# EasyEDA Pro project RadioFox.eprj, board PCB7
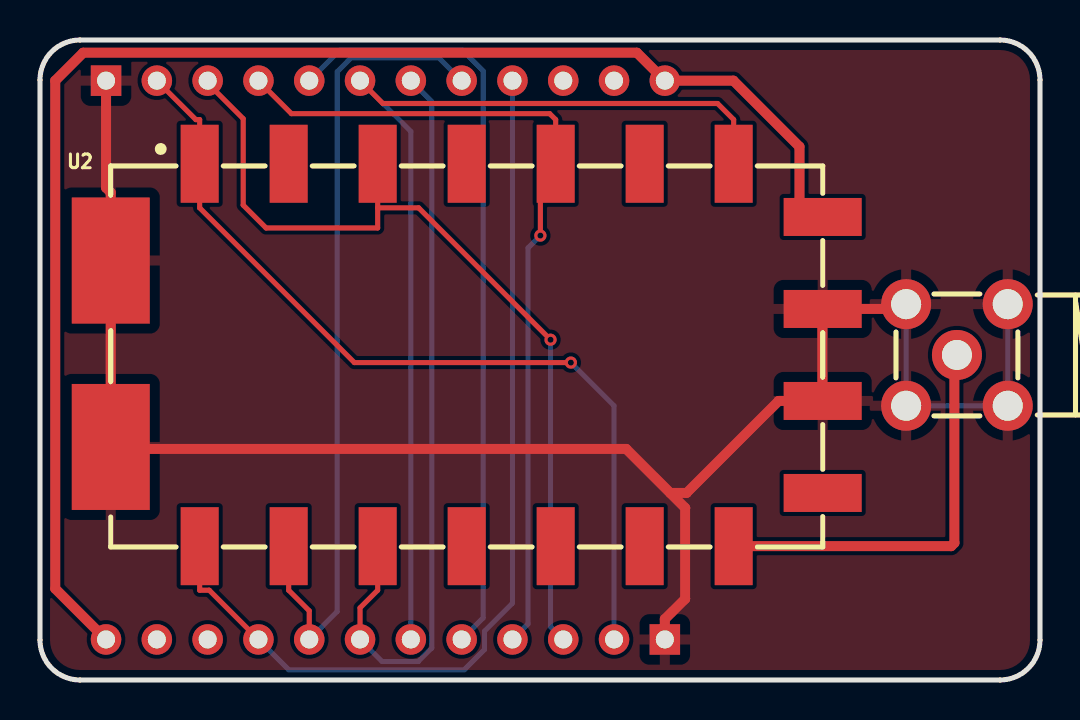
[diagram p6: board, top side]
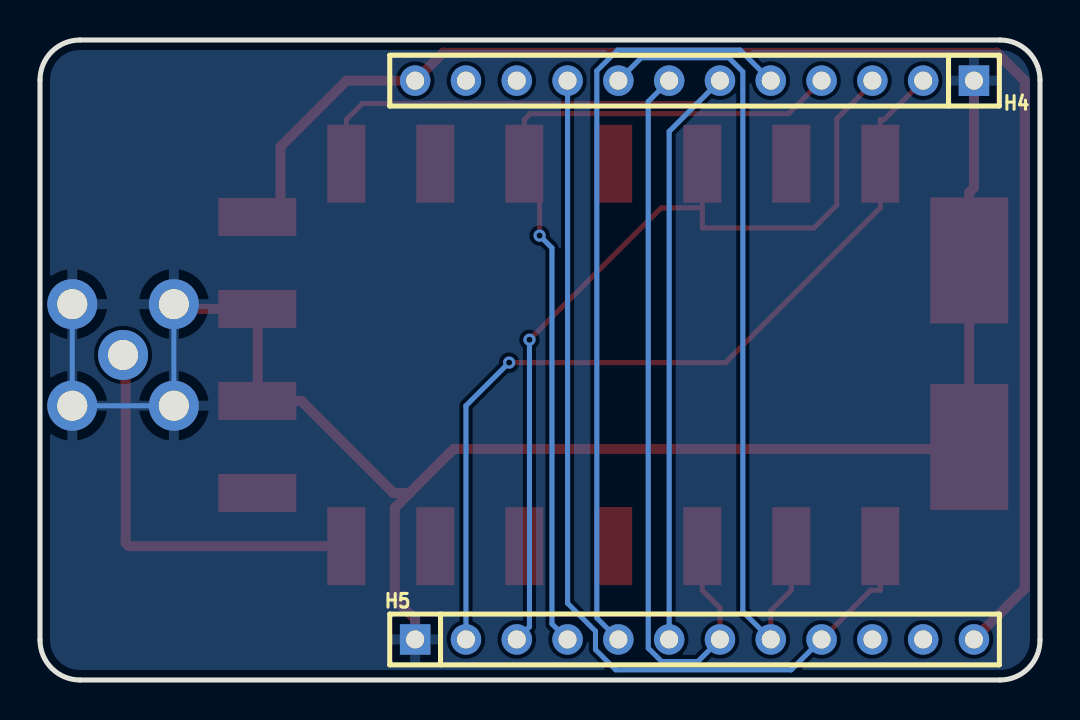
[diagram p7: board, bottom side, seen from below]

Outline 50 x 32 mm; copper layers: Top Layer, Bottom Layer. Coordinates in mm from the lower left corner of the outline.
Outline path: 0,30 0,2 arc(0.59,0.59) 2,0 48,0 arc(49.41,0.59) 50,2 50,30 arc(49.41,31.41) 48,32 2,32 arc(0.59,31.41) 0,30
Stack: Top Layer 0.035mm / Dielectric1 1.51mm FR4 er 4.5 / Bottom Layer 0.035mm

## Design rules (mm)
template: JLCPCB Capability(Two Layers Board)
spacing copperThickness1oz (default): track to track 0.102, other pairs 0.152 to 0.3
spacing copperThickness2oz: track to track 0.203, other pairs 0.152 to 0.3
track width copperThickness1oz (default): min 0.127, default 0.254, max 2.54
track width copperThickness2oz: min 0.203, default 0.254, max 2.54
differential pair differentialPair (default): width min 0.127, default 0.254, max 2.54; gap min 0.152, default 0.152
via viaSize (default): diameter min 0.5, default 0.61, max 10; hole min 0.3, default 0.305, max 6.3

## Placement (name value [footprint] x y rotation side)
H4  XDZ254C-1-12-Z-3.0-G1  [HDR-TH_12P-P2.54-V-M_1]  17.27 29.97 0 bottom
H5  XDZ254C-1-12-Z-3.0-G1  [HDR-TH_12P-P2.54-V-M_1]  17.27 2.03 180 bottom
RF1  KH-SMA-P-8496  [SMA-TH_KH-SMA-P-8496]  45.85 16.25 270 top
U2  SA818S-V  [WIRELM-SMD_G-NICERF_SA818S-X]  21.34 16.25 0 top

## Footprints (pads in the part's own frame, mm; a bottom-side part is the same pattern mirrored in y, then rotated)
HDR-TH_12P-P2.54-V-M_1
  rect 1.524x1.524 hole 0.9: 1(-13.97,0)
  round 1.524 hole 0.9: 2(-11.43,0) 3(-8.89,0) 4(-6.35,0) 5(-3.81,0) 6(-1.27,0) 7(1.27,0) 8(3.81,0) 9(6.35,0) 10(8.89,0) 11(11.43,0) 12(13.97,0)
SMA-TH_KH-SMA-P-8496
  round 2.5 hole 1.5: 1(-2.54,2.54) 2(2.54,2.54) 3(2.54,-2.54) 4(-2.54,-2.54) 5(0,0)
WIRELM-SMD_G-NICERF_SA818S-X
  rect 1.9x3.9 smd: 1(-13.352,9.56) 2(-8.902,9.56) 3(-4.452,9.56) 4(-0.003,9.56) 5(4.447,9.56) 6(8.898,9.56) 7(13.348,9.56) 12(13.348,-9.56) 13(8.898,-9.56) 14(4.447,-9.56) 15(-0.003,-9.56) 16(-4.452,-9.56) 17(-8.902,-9.56) 18(-13.352,-9.56)
  rect 3.9x1.9 smd: 8(17.797,6.9) 9(17.797,2.3) 10(17.797,-2.3) 11(17.797,-6.9)
  rect 3.9x6.3 smd: 19(-17.797,-4.6) 20(-17.797,4.72)

## Nets
GND: H4.1 H5.1 RF1.1 RF1.2 RF1.3 RF1.4 U2.9 U2.10 U2.19 U2.20
VDD: H4.12 H5.12 U2.8
AF_OUT: H4.3 H5.3 U2.3
AUDIO_ON: H4.2 H5.2 U2.1
H/L: H4.6 H5.6 U2.7
MIC_IN: H4.9 H5.9 U2.18
PTT: H4.4 H5.4 U2.5
RXD: H4.7 H5.7 U2.16
SLEEP: H4.5 H5.5
TXD: H4.8 H5.8 U2.17
$1N852: RF1.5 U2.12
$1N1686: U2.6

Pads without a net: H4 10 11; H5 10 11; U2 2 4 11 13 14 15

## Via types
v1: diameter 0.61, hole 0.305, Top Layer to Bottom Layer, 3 vias

## Routing (per net, layer and track width the routed paths; a pad name or vN(x,y) marks a point on that pad's centre or on a via; arc(x,y) is an arc through that point)
GND: length 88.4
  Top Layer w0.5: RF1.4 43.07,18.55 39.26,18.55 39.12,18.41 39.12,14.45 38.62,13.95 36.93,13.95 32.33,9.35 31.51,9.35 ; 31.51,9.35 29.31,11.55 4.04,11.55 3.54,12.05 3.54,24.38 3.3,24.61 H4.1 ; 31.51,9.35 32.26,8.61 32.26,4.05 31.24,3.05 H5.1
  Bottom Layer w0.254: RF1.4 RF1.3 RF1.2 RF1.1
VDD: length 73.4
  Top Layer w0.5: 39.13,23.15 37.97,23.15 37.97,26.67 34.67,29.97 H4.12 29.84,31.36 2.16,31.36 0.76,29.97 0.76,4.57 H5.12
AF_OUT: length 44
  Top Layer w0.254: H4.3 8.38,29.84 10.16,28.06 10.16,23.75 11.3,22.6 16.88,22.6 16.88,23.61 ; 16.88,23.61 18.93,23.61 v1(25.53,17.01) ; 16.88,23.61 U2.3
  Bottom Layer w0.254: v1(25.53,17.01) 25.53,2.66 26.16,2.03
AUDIO_ON: length 43.9
  Top Layer w0.254: 5.84,29.97 7.79,28.02 7.98,28.02 U2.1 7.98,23.61 15.72,15.87 v1(26.54,15.87)
  Bottom Layer w0.254: H5.2 28.7,13.71 v1(26.54,15.87)
H/L: length 50.7
  Top Layer w0.254: 16,29.97 17.14,28.83 33.88,28.83 34.68,28.02 U2.7
  Bottom Layer w0.254: H5.6 18.54,27.43 16,29.97
MIC_IN: length 47.5
  Top Layer w0.254: 7.98,6.69 7.98,4.49 8.46,4.49 H5.9
  Bottom Layer w0.254: H4.9 23.62,3.84 22.22,2.44 22.22,1.52 21.21,0.51 12.44,0.51 H5.9
PTT: length 42.6
  Top Layer w0.254: v1(25.02,22.22) 25.02,25.05 U2.5 25.78,28.02 25.48,28.32 12.57,28.32 H4.4
  Bottom Layer w0.254: v1(25.02,22.22) 24.4,21.6 24.4,2.81 H5.4
RXD: length 38.2
  Top Layer w0.254: 16.88,6.69 16.88,4.49 16,3.61 16,2.03
  Bottom Layer w0.254: 16,2.03 17.1,0.92 18.92,0.92 19.59,1.59 19.59,28.92 H4.7
SLEEP: length 38.6
  Bottom Layer w0.254: H5.5 22.16,3.1 22.16,30.46 21.12,31.49 14.99,31.49 H4.5
TXD: length 41
  Top Layer w0.254: H5.8 13.46,3.46 12.43,4.49 12.43,6.69
  Bottom Layer w0.254: H5.8 14.86,3.42 14.86,30.41 15.56,31.11 19.94,31.11 H4.8
$1N852: length 20.6
  Top Layer w0.5: RF1.5 45.72,16.12 45.72,6.85 45.56,6.69 U2.12

## Copper pours and planes (outline as drawn; the poured copper is in the pictures)
GND on Top Layer: -0.13,32.13 50.04,32.13 50.04,-0.13 -0.13,-0.13
GND on Bottom Layer: -0.13,32.13 50.04,32.13 50.04,0 -0.13,0
